# EAGLE design f-meter-1.1 (EAGLE 6.4)
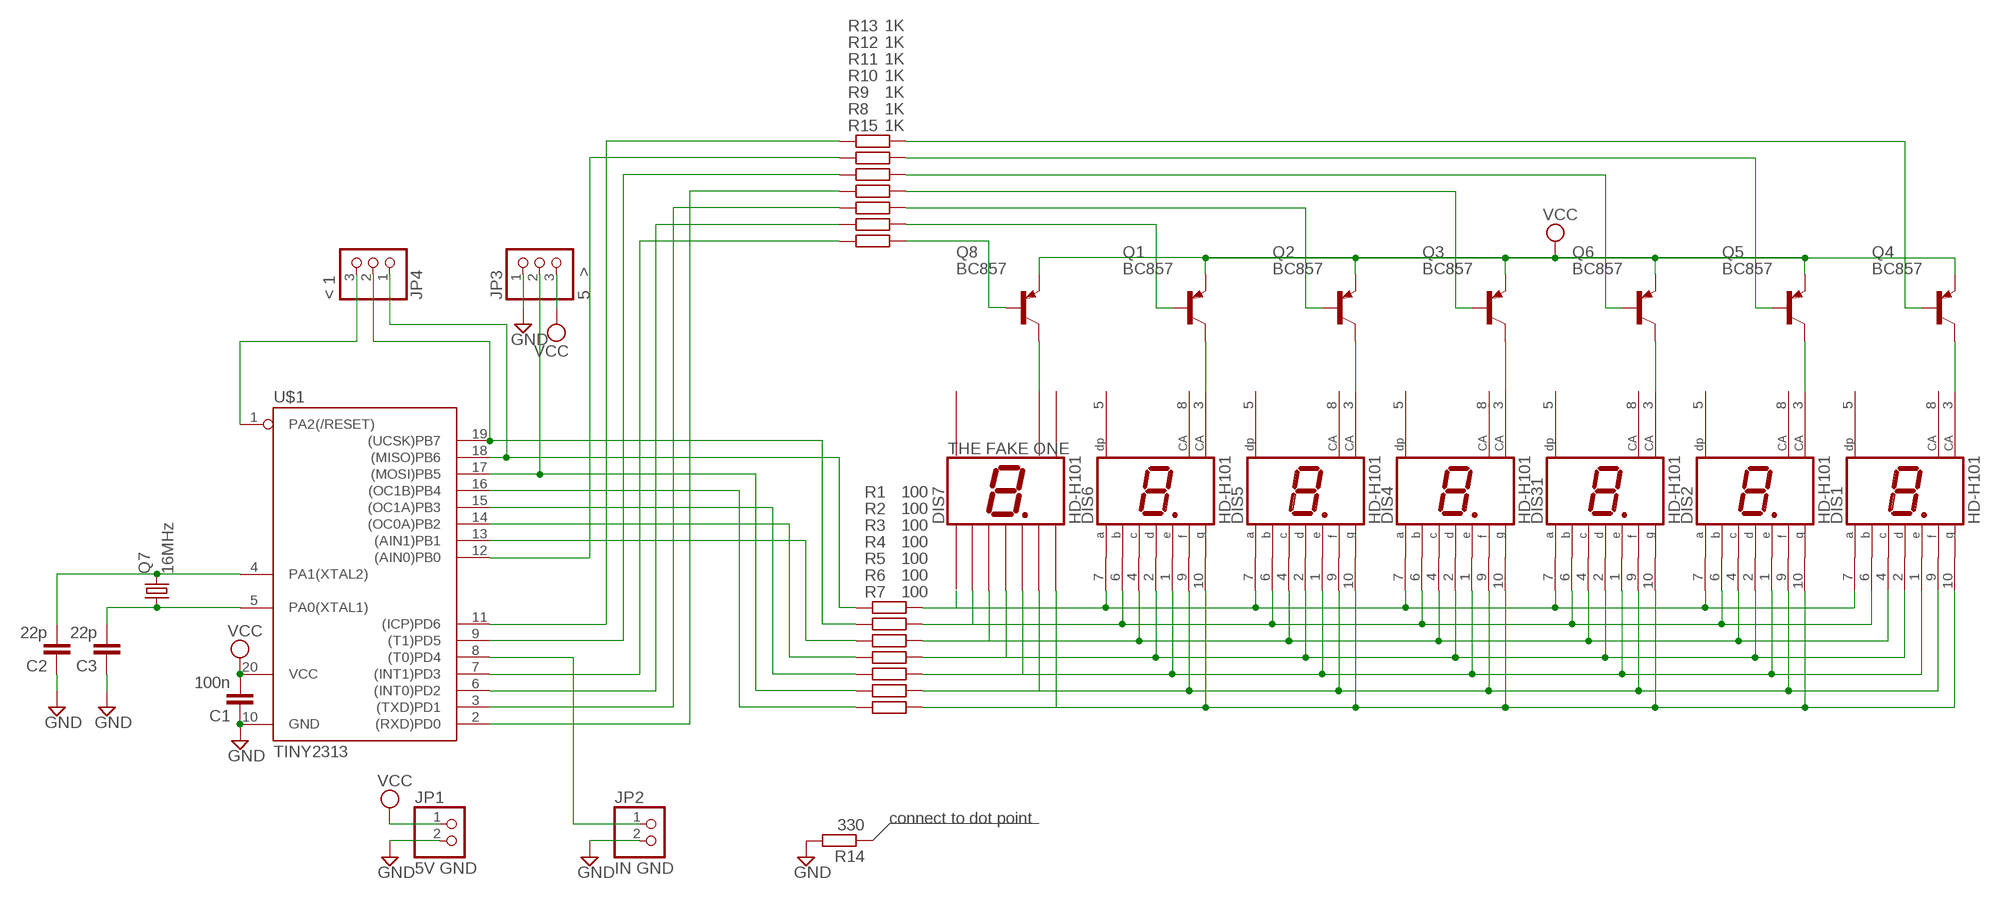
[diagram p0: schematic, sheet 1]

## Parts
C1  100n  C-EUC0805  [C0805]
C2  22p  C-EUC0805  [C0805]
C3  22p  C-EUC0805  [C0805]
DIS1  HD-H101  [HDSP-M]
DIS2  HD-H101  [HDSP-M]
DIS4  HD-H101  [HDSP-M]
DIS5  HD-H101  [HDSP-M]
DIS6  HD-H101  [HDSP-M]
DIS31  HD-H101  [HDSP-M]
JP1  5V GND  PINHD-1X2  [1X02]
JP2  IN GND  PINHD-1X2  [1X02]
JP3  5 >  PINHD-1X03_2.54-SMD-90°  [1X03SMD/90]
JP4  < 1  PINHD-1X03_2.54-SMD-90°  [1X03SMD/90]
Q1  BC857  BC857ASMD  [SOT23-BEC]
Q2  BC857  BC857ASMD  [SOT23-BEC]
Q3  BC857  BC857ASMD  [SOT23-BEC]
Q4  BC857  BC857ASMD  [SOT23-BEC]
Q5  BC857  BC857ASMD  [SOT23-BEC]
Q6  BC857  BC857ASMD  [SOT23-BEC]
Q7  16MHz  CRYSTALHC49S  [HC49/S]
Q8  BC857  BC857ASMD  [SOT23-BEC]
R1  100  R-EU_M0805  [M0805]
R2  100  R-EU_M0805  [M0805]
R3  100  R-EU_M0805  [M0805]
R4  100  R-EU_M0805  [M0805]
R5  100  R-EU_M0805  [M0805]
R6  100  R-EU_M0805  [M0805]
R7  100  R-EU_M0805  [M0805]
R8  1K  R-EU_M0805  [M0805]
R9  1K  R-EU_M0805  [M0805]
R10  1K  R-EU_M0805  [M0805]
R11  1K  R-EU_M0805  [M0805]
R12  1K  R-EU_M0805  [M0805]
R13  1K  R-EU_M0805  [M0805]
R14  330  R-EU_M0805  [M0805]
R15  1K  R-EU_M0805  [M0805]
U$1  TINY2313  TINY2313-*S*  [SO20L$]

## Nets
GND: C1.1 C2.1 C3.1 JP1.2 JP2.2 JP3.1 R14.2 U$1.10(GND)
N$1: C2.2 Q7.2 U$1.4(PA1(XTAL2))
N$2: C3.2 Q7.1 U$1.5(PA0(XTAL1))
N$3: DIS1.2(D) DIS2.2(D) DIS4.2(D) DIS5.2(D) DIS6.2(D) DIS31.2(D) R4.2
N$4: DIS1.1(E) DIS2.1(E) DIS4.1(E) DIS5.1(E) DIS6.1(E) DIS31.1(E) R5.2
N$5: DIS6.3(CA) Q1.C
N$6: DIS5.3(CA) Q2.C
N$7: DIS4.3(CA) Q3.C
N$8: DIS31.3(CA) Q6.C
N$9: DIS2.3(CA) Q5.C
N$10: DIS1.3(CA) Q4.C
N$11: Q1.B R8.2
N$12: Q2.B R9.2
N$13: Q3.B R10.2
N$14: Q6.B R11.2
N$15: Q5.B R12.2
N$16: Q4.B R13.2
N$17: R8.1 U$1.6((INT0)PD2)
N$18: DIS1.9(F) DIS2.9(F) DIS4.9(F) DIS5.9(F) DIS6.9(F) DIS31.9(F) R6.2
N$19: DIS1.7(A) DIS2.7(A) DIS4.7(A) DIS5.7(A) DIS6.7(A) DIS31.7(A) R1.2
N$20: DIS1.6(B) DIS2.6(B) DIS4.6(B) DIS5.6(B) DIS6.6(B) DIS31.6(B) R2.2
N$21: DIS1.4(C) DIS2.4(C) DIS4.4(C) DIS5.4(C) DIS6.4(C) DIS31.4(C) R3.2
N$22: DIS1.10(G) DIS2.10(G) DIS4.10(G) DIS5.10(G) DIS6.10(G) DIS31.10(G) R7.2
N$23: JP4.1 R1.1 U$1.18((MISO)PB6)
N$24: JP4.3 U$1.1(PA2(/RESET))
N$25: Q8.C
N$26: Q8.B R15.2
N$27: R15.1 U$1.7((INT1)PD3)
N$29: JP2.1 U$1.8((T0)PD4)
N$31: R9.1 U$1.3((TXD)PD1)
N$32: R10.1 U$1.2((RXD)PD0)
N$33: R11.1 U$1.9((T1)PD5)
N$34: R12.1 U$1.12((AIN0)PB0)
N$35: R13.1 U$1.11((ICP)PD6)
N$38: JP4.2 R2.1 U$1.19((UCSK)PB7)
N$39: R3.1 U$1.13((AIN1)PB1)
N$40: R4.1 U$1.14((OC0A)PB2)
N$41: R5.1 U$1.15((OC1A)PB3)
N$42: JP3.2 R6.1 U$1.17((MOSI)PB5)
N$43: R7.1 U$1.16((OC1B)PB4)
VCC: C1.2 JP1.1 JP3.3 Q1.E Q2.E Q3.E Q4.E Q5.E Q6.E Q8.E U$1.20(VCC)
Unconnected: DIS1.5(DP) DIS1.8(CA) DIS2.5(DP) DIS2.8(CA) DIS4.5(DP) DIS4.8(CA) DIS5.5(DP) DIS5.8(CA) DIS6.5(DP) DIS6.8(CA) DIS31.5(DP) DIS31.8(CA) R14.1

## Notes on the sheet
- THE FAKE ONE
- DIS7 | HD-H101
- connect to dot point

## Library data of the parts
C1-C3 = rcl:C-EU: CAPACITOR, European symbol
DIS1 DIS2 DIS4-DIS6 DIS31 = display-hp:HD-H101: LED DISPLAY 1-character 7 segment, decimal point right
JP1 JP2 = pinhead:PINHD-1X2: PIN HEADER
JP3 JP4 = pinhead-2:PINHD-1X03: PIN HEADER
Q1-Q6 Q8 = transistor-pnp:BC857*: PNP Transistror
Q7 = crystal:CRYSTAL: CRYSTAL
R1-R15 = rcl:R-EU_: RESISTOR, European symbol
U$1 = avr-6:TINY2313*: Atmel Tiny2313 2K Flash, 128 bytes EEPROM, 128 bytes RAM

## Board
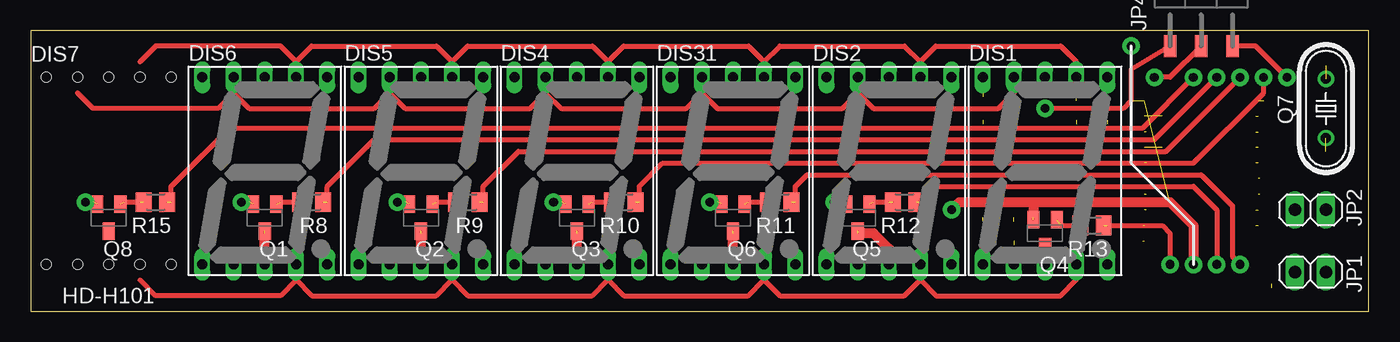
[diagram p1: board, top side]
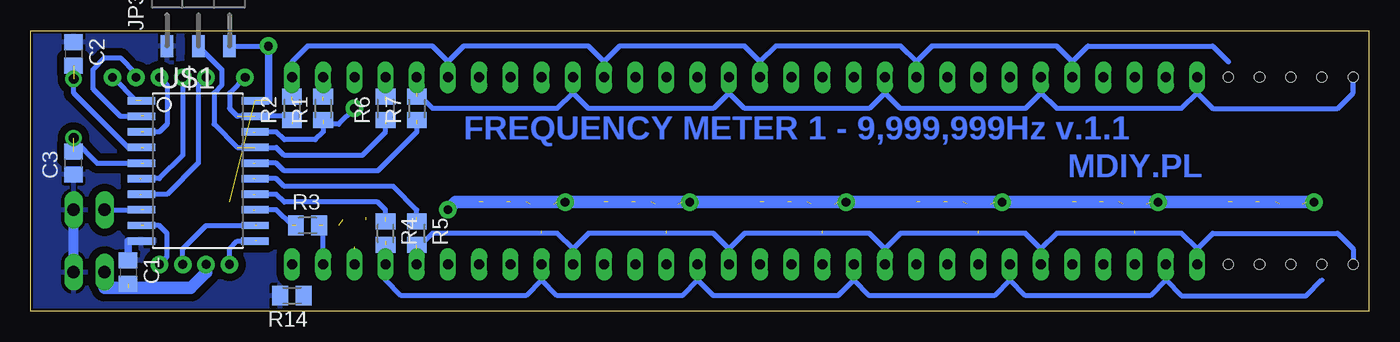
[diagram p2: board, bottom side, seen from below]

Size 108.89 x 22.85 mm. Coordinates in mm from the lower left corner, seen from the top.
Outline: 0,0 108.89,0 108.89,22.85 0,22.85 0,0
Copper layers (1*16): Top 0.035mm / dielectric 1.5mm / Bottom 0.035mm
Design rules "default *": minimum track width 10mil, minimum drill 24mil, track to track 24mil, track to pad 24mil, pad to pad 8mil, via to via 8mil, smd to smd 8mil, copper to edge 8mil, drill to drill 8mil, minimum pad ring 10mil, minimum via ring 8mil, stop-mask expansion 4mil, vias tented up to drill 0mil, thermal gap 10mil
Holes 0.8 mm at 11.43,19.05 8.89,19.05 6.35,19.05 3.81,19.05 1.27,19.05 1.27,3.81 3.81,3.81 6.35,3.81 8.89,3.81 11.43,3.81

### Footprints (pad centres in the part's own frame; a part is rotated, then mirrored left to right if it is on the bottom)
C0805 = smd 1.3 x 1.5: 1 -0.95,0; 2 0.95,0
HDSP-M = drill 0.813 long: 1 -5.08,-7.62; 2 -2.54,-7.62; 3 0,-7.62; 4 2.54,-7.62; 5 5.08,-7.62; 6 5.08,7.62; 7 2.54,7.62; 8 0,7.62; 9 -2.54,7.62; 10 -5.08,7.62
1X02 = drill 1.016 long: 1 -1.27,0; 2 1.27,0
1X03SMD/90 = smd 1.016 x 1.778: 1 -1.27,-5.08; 2 1.27,-5.08; 3 3.81,-5.08
SOT23-BEC = smd 1 x 1.4: B -0.95,-1.1; C 0,1.1; E 0.95,-1.1
HC49/S = drill 0.813: 1 -2.413,0; 2 2.413,0
M0805 = smd 1.3 x 1.6: 1 -0.95,0; 2 0.95,0
SO20L$ = smd 0.61 x 2.21: 1 -5.715,-4.636; 2 -4.445,-4.636; 3 -3.175,-4.636; 4 -1.905,-4.636; 5 -0.635,-4.636; 6 0.635,-4.636; 7 1.905,-4.636; 8 3.175,-4.636; 9 4.445,-4.636; 10 5.715,-4.636; 11 5.715,4.61; 12 4.445,4.636; 13 3.175,4.636; 14 1.905,4.636; 15 0.635,4.636; 16 -0.635,4.636; 17 -1.905,4.636; 18 -3.175,4.636; 19 -4.445,4.636; 20 -5.715,4.636

### Placement (x,y rotation side)
C1  100.97,3.17 270 bottom
C2  105.41,20.95 270 bottom
C3  105.41,12.06 90 bottom
DIS1  82.55,11.43 0 top
DIS2  69.85,11.43 0 top
DIS4  44.45,11.43 0 top
DIS5  31.75,11.43 0 top
DIS6  19.05,11.43 0 top
DIS31  57.15,11.43 0 top
JP1  104.14,3.17 0 top
JP2  104.14,8.26 0 top
JP3  96.52,26.67 0 bottom
JP4  93.98,26.67 0 top
Q1  19.05,7.62 180 top
Q2  31.75,7.62 180 top
Q3  44.45,7.62 180 top
Q4  82.55,6.35 180 top
Q5  67.31,7.62 180 top
Q6  57.15,7.62 180 top
Q7  105.41,16.51 90 top
Q8  6.35,7.62 180 top
R1  85.09,16.51 90 bottom
R2  87.63,16.51 90 bottom
R3  86.36,6.99 0 bottom
R4  80.01,6.35 270 bottom
R5  77.47,6.35 270 bottom
R6  80.01,16.51 90 bottom
R7  77.47,16.51 90 bottom
R8  22.86,8.89 180 top
R9  35.56,8.89 180 top
R10  48.26,8.89 180 top
R11  60.96,8.89 180 top
R12  71.12,8.89 180 top
R13  86.36,6.99 180 top
R14  87.63,1.27 180 bottom
R15  10.16,8.89 180 top
U$1  95.25,11.43 270 bottom

### Tracks (layer width: path | path; a pad name or v marks a point on that pad's centre or on a via)
GND
  Bottom 0.61: 99.7,5.71 100.97,5.71 100.97,4.45
  Bottom 0.813: JP1.2 JP2.2
  pour Bottom: 86.36,0 109.22,0 109.22,22.86 86.36,22.86
N$1  (3 unrouted)
  Bottom 0.406: 99.7,13.34 100.97,13.34 105.41,17.78 105.41,19.68
N$2  (3 unrouted)
  Bottom 0.406: 105.41,13.97 103.5,12.06 99.7,12.06
N$3  (1 unrouted)
  Bottom 0.406: DIS6.2 16.51,2.54 | 16.51,2.54 17.78,1.27 27.94,1.27 29.21,2.54 | DIS5.2 29.21,2.54 | 29.21,2.54 30.48,1.27 40.64,1.27 41.91,2.54 | DIS4.2 41.91,2.54 | 41.91,2.54 43.18,1.27 53.34,1.27 54.61,2.54 | DIS31.2 54.61,2.54 | 54.61,2.54 55.88,1.27 66.04,1.27 67.31,2.54 | DIS2.2 67.31,2.54 | 67.31,2.54 68.58,1.27 78.74,1.27 80.01,2.54 DIS1.2 80.01,5.71 | 16.51,2.54 15.24,1.27 5.08,1.27 3.81,2.54
N$4  (1 unrouted)
  Bottom 0.406: DIS6.1 13.97,5.08 | 13.97,5.08 15.24,6.35 25.4,6.35 26.67,5.08 | DIS5.1 26.67,5.08 | 26.67,5.08 27.94,6.35 38.1,6.35 39.37,5.08 | DIS4.1 39.37,5.08 | 39.37,5.08 40.64,6.35 50.8,6.35 52.07,5.08 | DIS31.1 52.07,5.08 | 52.07,5.08 53.34,6.35 63.5,6.35 64.77,5.08 | DIS2.1 64.77,5.08 | 64.77,5.08 66.04,6.35 76.2,6.35 77.47,5.08 | DIS1.1 77.47,5.08 | 77.47,5.08 77.47,5.71 | 13.97,5.08 12.7,6.35 2.54,6.35 1.27,5.08 1.27,3.81
N$5  (1 unrouted)
  Top 0.813: DIS6.3 19.05,6.35
N$6  (1 unrouted)
  Top 0.813: DIS5.3 31.75,6.35
N$7  (1 unrouted)
  Top 0.813: DIS4.3 44.45,6.35
N$8  (1 unrouted)
  Top 0.813: DIS31.3 57.15,6.35
N$9  (1 unrouted)
  Top 0.813: DIS2.3 69.85,5.08 68.58,6.35 67.31,6.35
N$10  (1 unrouted)
  Top 0.813: DIS1.3 82.55,5.08
N$11  (2 unrouted)
  Top 0.406: 20.32,8.89 21.59,8.89
N$12  (2 unrouted)
  Top 0.406: 33.02,8.89 34.29,8.89
N$13  (2 unrouted)
  Top 0.406: 45.72,8.89 46.99,8.89
N$14  (2 unrouted)
  Top 0.406: 58.42,8.89 59.69,8.89
N$15  (2 unrouted)
  Top 0.406: 68.58,8.89 69.85,8.89
N$16  (2 unrouted)
  Top 0.406: 83.82,6.99 85.09,6.99
N$17  (via drill 0.7 pad 1.42)  (2 unrouted)
  Top 0.406: 24.13,8.89 24.13,10.16 27.94,13.97 91.44,13.97 v96.52,19.05
  Bottom 0.406: v96.52,19.05 96.52,12.7 98.42,10.79 100.01,10.79
N$18  (1 unrouted)
  Top 0.406: DIS6.9 16.51,17.78 | 16.51,17.78 17.78,16.51 27.94,16.51 29.21,17.78 | DIS5.9 29.21,17.78 | 29.21,17.78 30.48,16.51 40.64,16.51 41.91,17.78 | DIS4.9 41.91,17.78 | 41.91,17.78 43.18,16.51 53.34,16.51 54.61,17.78 | DIS31.9 54.61,17.78 | 54.61,17.78 55.88,16.51 66.04,16.51 67.31,17.78 | DIS2.9 67.31,17.78 | 67.31,17.78 68.58,16.51 78.74,16.51 80.01,17.78 DIS1.9 | 16.51,17.78 15.24,16.51 5.08,16.51 3.81,17.78
  Bottom 0.406: DIS1.9 80.01,17.14
N$19  (1 unrouted)
  Top 0.406: DIS6.7 21.59,20.32 | 21.59,20.32 22.86,21.59 33.02,21.59 34.29,20.32 | DIS5.7 34.29,20.32 | 34.29,20.32 35.56,21.59 45.72,21.59 46.99,20.32 | DIS4.7 46.99,20.32 | 46.99,20.32 48.26,21.59 58.42,21.59 59.69,20.32 | DIS31.7 59.69,20.32 | 59.69,20.32 60.96,21.59 71.12,21.59 72.39,20.32 | DIS2.7 72.39,20.32 | 72.39,20.32 73.66,21.59 83.82,21.59 85.09,20.32 DIS1.7 | 21.59,20.32 20.32,21.59 10.16,21.59 8.89,20.32
  Bottom 0.406: DIS1.7 85.09,17.14
N$20  (1 unrouted)
  Bottom 0.406: 24.13,20.32 25.4,21.59 35.56,21.59 36.83,20.32 | DIS5.6 36.83,20.32 | 36.83,20.32 38.1,21.59 48.26,21.59 49.53,20.32 | DIS4.6 49.53,20.32 | 49.53,20.32 50.8,21.59 60.96,21.59 62.23,20.32 | 62.23,20.32 DIS31.6 | 62.23,20.32 63.5,21.59 73.66,21.59 74.93,20.32 | 74.93,20.32 DIS2.6 | 74.93,20.32 76.2,21.59 86.36,21.59 87.63,20.32 DIS1.6 87.63,17.14 | DIS6.6 24.13,20.32 | 24.13,20.32 22.86,21.59 12.7,21.59 11.43,20.32
N$21  (1 unrouted)
  Top 0.406: DIS6.4 21.59,2.54 | 21.59,2.54 22.86,1.27 33.02,1.27 34.29,2.54 | DIS5.4 34.29,2.54 | 34.29,2.54 35.56,1.27 45.72,1.27 46.99,2.54 | 46.99,2.54 DIS4.4 | 46.99,2.54 48.26,1.27 58.42,1.27 59.69,2.54 | DIS31.4 59.69,2.54 | 59.69,2.54 60.96,1.27 71.12,1.27 72.39,2.54 | DIS2.4 72.39,2.54 | 72.39,2.54 73.66,1.27 83.82,1.27 85.09,2.54 DIS1.4 | 21.59,2.54 20.32,1.27 10.16,1.27 8.89,2.54
  Bottom 0.406: DIS1.4 85.09,6.99
N$22  (1 unrouted)
  Bottom 0.406: 13.97,17.78 15.24,16.51 25.4,16.51 26.67,17.78 | 26.67,17.78 DIS5.10 | 26.67,17.78 27.94,16.51 38.1,16.51 39.37,17.78 | DIS4.10 39.37,17.78 | 39.37,17.78 40.64,16.51 50.8,16.51 52.07,17.78 | DIS31.10 52.07,17.78 | 52.07,17.78 53.34,16.51 63.5,16.51 64.77,17.78 | DIS2.10 64.77,17.78 | 64.77,17.78 66.04,16.51 76.2,16.51 77.47,17.78 | 77.47,17.78 DIS1.10 | 77.47,17.78 77.47,17.14 | DIS6.10 13.97,17.78 | 13.97,17.78 12.7,16.51 2.54,16.51 1.27,17.78 1.27,19.05
N$23  (via drill 0.7 pad 1.42)  (2 unrouted)
  Top 0.406: JP4.1 89.53,19.68 89.53,17.14 88.9,16.51 v82.55,16.51
  Bottom 0.406: 90.81,14.61 88.9,14.61 88.27,13.97 85.73,13.97 85.09,14.61 85.09,15.24 83.82,15.24 v82.55,16.51
N$24  (via drill 0.7 pad 1.42)  (1 unrouted)
  Top 0.406: v102.23,19.05 99.7,21.59 JP4.3
  Bottom 0.406: v102.23,19.05 100.33,17.14
N$26  (2 unrouted)
  Top 0.406: 7.62,8.89 8.89,8.89
N$27  (via drill 0.7 pad 1.42)  (2 unrouted)
  Top 0.406: 11.43,8.89 11.43,10.16 16.19,14.92 90.49,14.92 v94.62,19.05
  Bottom 0.406: v94.62,19.05 95.25,18.41 95.25,12.06 97.79,9.53 100.01,9.53
N$29  (1 unrouted)
  Bottom 0.406: JP2.1 99.7,8.26
N$31  (via drill 0.7 pad 1.42)  (2 unrouted)
  Top 0.406: 36.83,8.89 36.83,10.16 39.69,13.02 92.39,13.02 v98.42,19.05
  Bottom 0.406: v98.42,19.05 97.79,18.41 97.79,15.24 98.42,14.61 99.7,14.61
N$32  (via drill 0.7 pad 1.42)  (2 unrouted)
  Top 0.406: 49.53,8.89 49.53,10.16 51.44,12.06 94.62,12.06 100.33,17.78 v100.33,19.05
  Bottom 0.406: 99.7,15.88 101.6,15.88 103.82,18.1 103.82,19.68 102.87,20.64 101.6,20.64 100.33,19.37 v100.33,19.05
N$33  (via drill 0.7 pad 1.42)  (2 unrouted)
  Top 0.406: 62.23,8.89 62.23,10.16 63.18,11.11 95.25,11.11 97.79,8.57 97.79,4.45 v98.42,3.81
  Bottom 0.406: v98.42,3.81 97.79,4.45 97.79,6.35 98.42,6.99 99.7,6.99
N$34  (via drill 0.7 pad 1.42)  (2 unrouted)
  Top 0.406: 72.39,8.89 73.66,10.16 94.62,10.16 96.52,8.26 v96.52,3.81
  Bottom 0.406: v96.52,3.81 96.52,5.08 94.62,6.99 90.49,6.99
N$35  (via drill 0.7 pad 1.42)  (2 unrouted)
  Top 0.406: 87.63,6.99 92.08,6.99 92.71,6.35 v92.71,3.81
  Bottom 0.406: v92.71,3.81 92.71,5.08 92.08,5.71 90.49,5.71
N$37
  Bottom 0.406: 90.17,5.71 90.81,5.71
N$38  (via drill 0.7 pad 1.42)  (2 unrouted)
  Top 0.406: JP4.2 92.71,19.05 v91.44,19.05
  Bottom 0.406: 87.63,15.24 88.27,15.88 92.08,15.88 92.71,16.51 92.71,17.78 v91.44,19.05
N$39  (2 unrouted)
  Bottom 0.406: 87.63,6.99 88.9,8.26 90.81,8.26
N$40  (2 unrouted)
  Bottom 0.406: 80.01,7.62 80.01,8.26 80.64,8.89 88.27,8.89 88.9,9.53 90.81,9.53
N$41  (2 unrouted)
  Bottom 0.406: 77.47,7.62 77.47,8.26 79.38,10.16 88.27,10.16 88.9,10.79 90.81,10.79
N$42  (2 unrouted)
  Bottom 0.406: 80.01,15.24 80.01,14.61 81.92,12.7 88.27,12.7 88.9,13.34 92.08,13.34 93.98,15.24 93.98,17.78 93.34,18.41 93.34,19.68 JP3.2
N$43  (2 unrouted)
  Bottom 0.406: 77.47,15.24 77.47,14.61 80.64,11.43 88.27,11.43 88.9,12.06 90.81,12.06
VCC  (via drill 0.7 pad 1.42)  (10 unrouted)
  Top 0.406: v4.45,8.89 5.08,8.89 | v17.14,8.89 17.78,8.89 | v29.84,8.89 30.48,8.89 | v42.55,8.89 43.18,8.89 | v65.41,8.89 66.04,8.89 | v55.25,8.89 55.88,8.89
  Top 0.813: v74.93,8.26 75.56,8.89 81.6,8.89 | 81.6,8.89 81.6,7.62 | 81.6,8.89 92.71,8.89 94.62,6.99 v94.62,3.81
  Bottom 0.406: JP3.3 v89.53,21.59
  Bottom 0.61: 100.97,1.91 100.97,2.54 | v89.53,21.59 89.53,17.14
  Bottom 1.016: v74.93,8.26 74.3,8.89 v65.41,8.89 v55.25,8.89 v42.55,8.89 v29.84,8.89 v17.14,8.89 v4.45,8.89 | JP1.1 102.87,1.91 100.97,1.91 95.89,1.91 94.62,3.17 v94.62,3.81

### Text on the board
Bottom: FREQUENCY METER 1 - 9,999,999Hz v.1.1 | MDIY.PL
tPlace: HD-H101
tNames: DIS7